# Altium schematic sheet RT v1.3_CORE.SchDoc
size A3
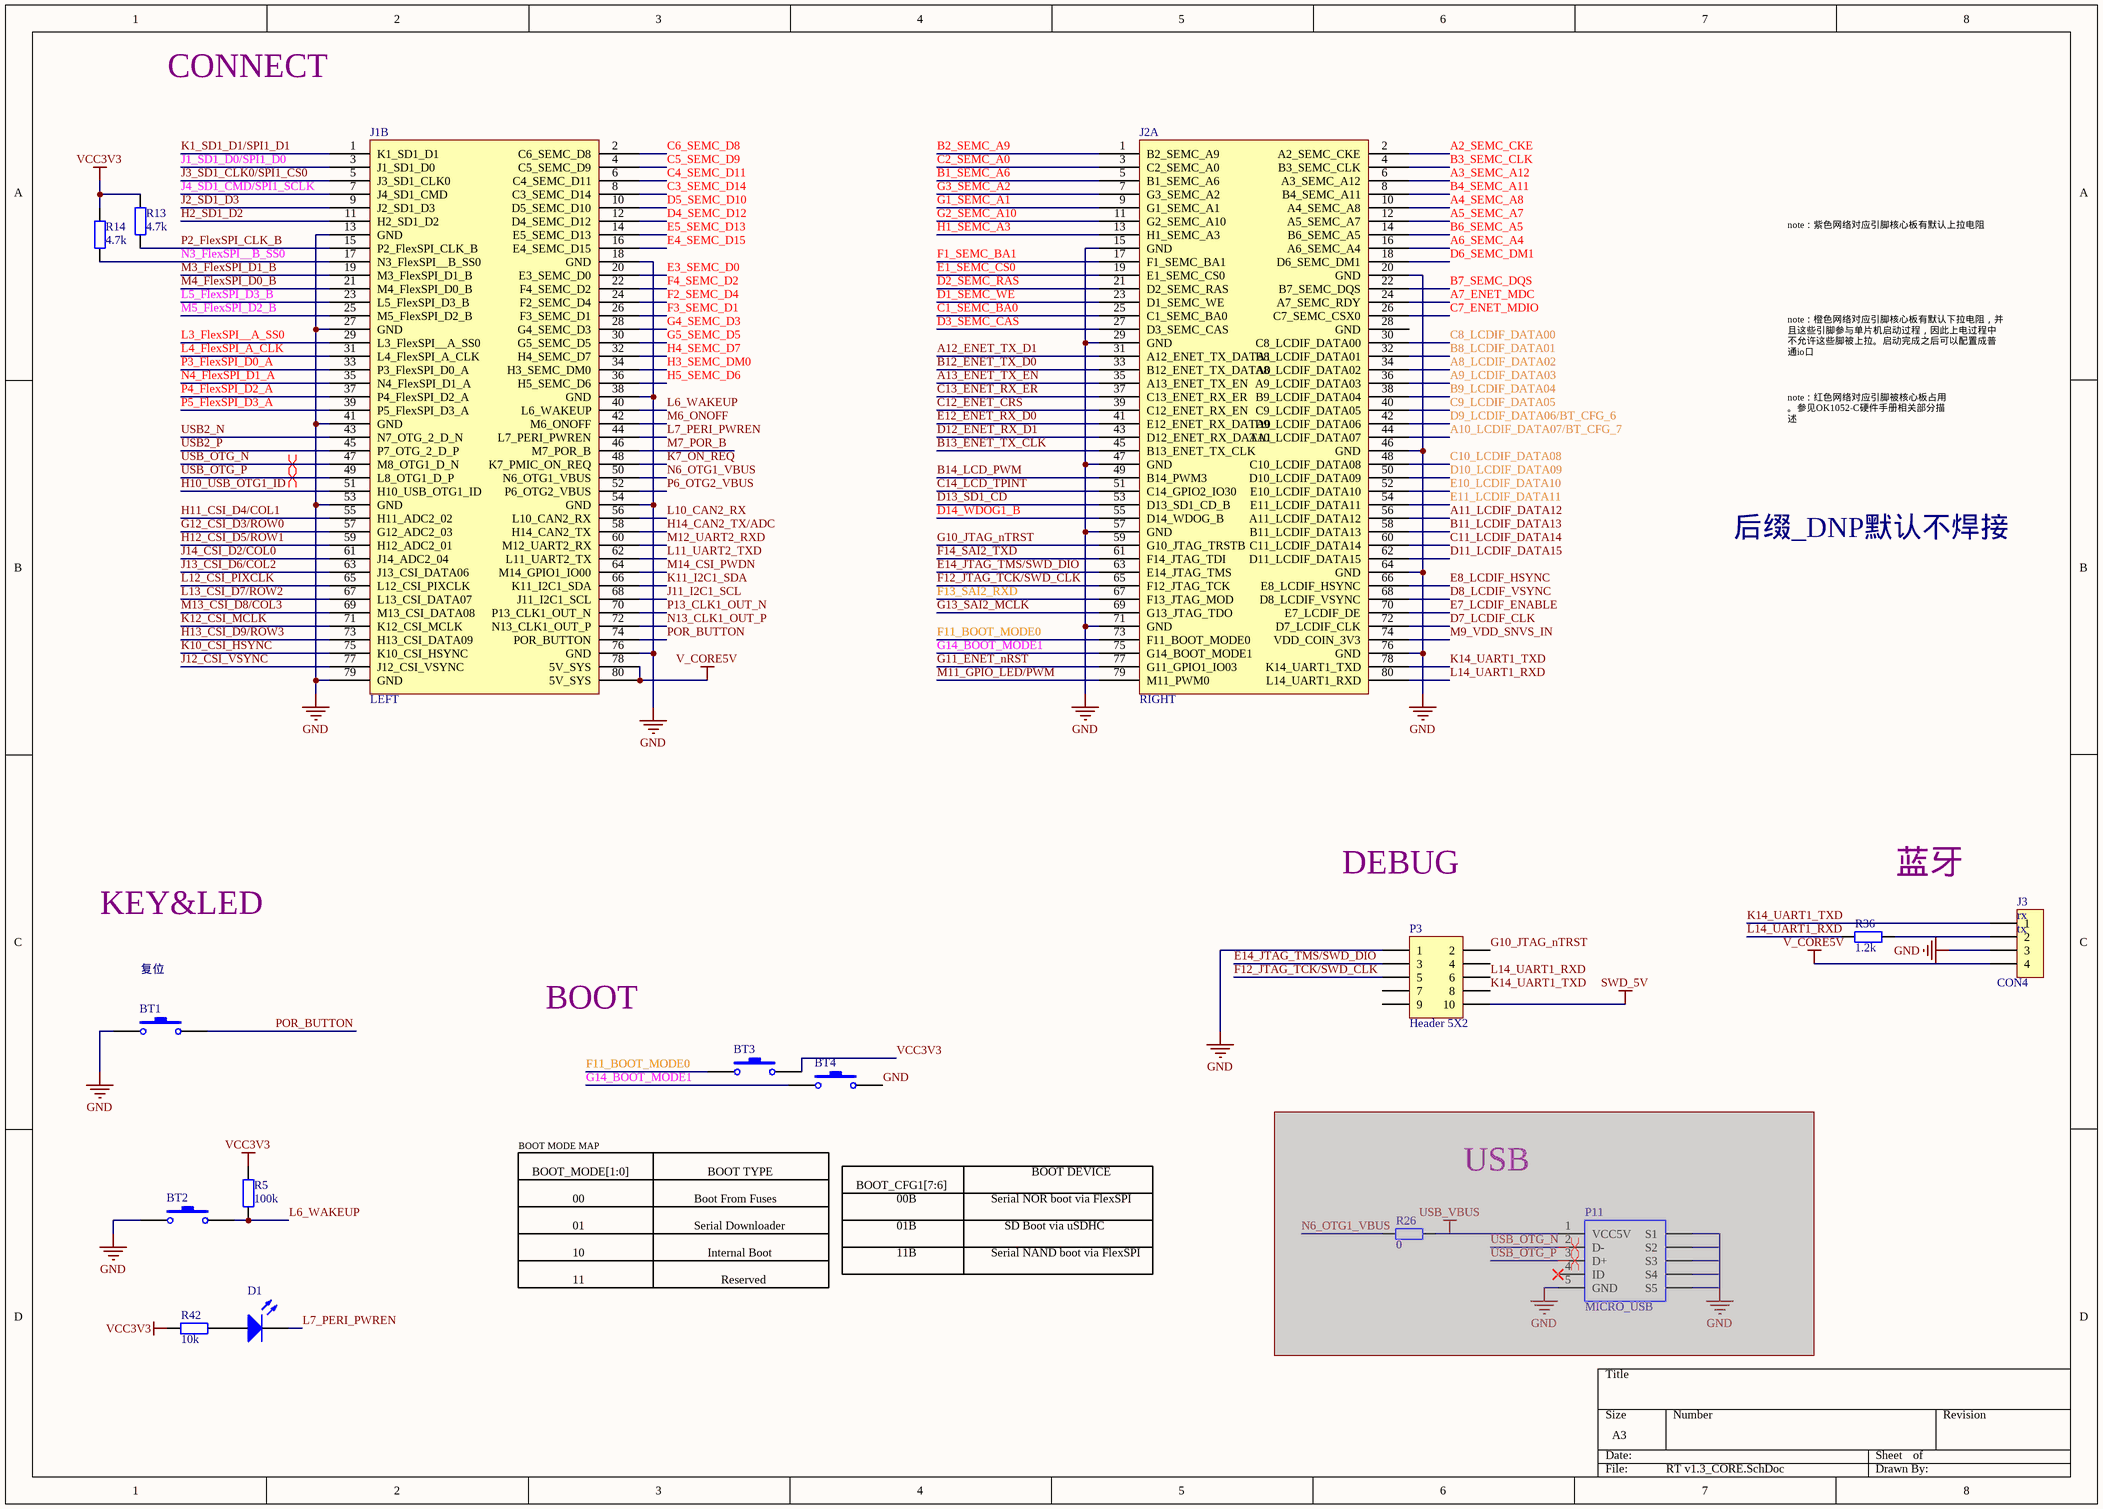
[diagram p0: RT v1.3_CORE.SchDoc]

## Parts
BT1  按键  [2脚小按键_贴]  (value not drawn)
BT2  按键  [2脚小按键_贴]  (value not drawn)
BT3  按键  [2脚小按键_贴]  (value not drawn)
BT4  按键  [2脚小按键_贴]  (value not drawn)
D1  LED2  [LED_0603_G]  (value not drawn)
J1  LEFT  [CON80]  (part B of 2)
J2  RIGHT  [CON80]  (part A of 2)
J3  CON4  [Fe-HDR1X4/2.54-S]
P3  Header 5X2  [HDR2X5]
P11  MICRO_USB  [microUSB]  (masked out: inside a compile mask, not in the netlist)
R5  value 100k  [0603R]  (hidden comment: 470欧)
R13  value 4.7k  [0603R]  (hidden comment: 470欧)
R14  value 4.7k  [0603R]  (hidden comment: 470欧)
R26  value 0  [0603R]  (hidden comment: 470欧)  (masked out: inside a compile mask, not in the netlist)
R36  value 1.2k  [0603R]  (hidden comment: 470欧)
R42  value 10k  [0603R]  (hidden comment: 470欧)

## Nets
GND: BT1.1 BT2.1 BT4.2 J1.13(GND) J1.18(GND) J1.27(GND) J1.38(GND) J1.41(GND) J1.53(GND) J1.54(GND) J1.76(GND) J1.79(GND) J2.15(GND) J2.20(GND) J2.29(GND) J2.46(GND) J2.47(GND) J2.57(GND) J2.64(GND) J2.71(GND) J2.76(GND) J3.3 P3.1
SWD_5V: P3.10
V_CORE5V: J1.78(5V_SYS) J1.80(5V_SYS) J3.4
VCC3V3: BT3.2 R5.2 R13.2 R14.2 R42.2
A2_SEMC_CKE: J2.2(A2_SEMC_CKE)
A3_SEMC_A12: J2.6(A3_SEMC_A12)
A4_SEMC_A8: J2.10(A4_SEMC_A8)
A5_SEMC_A7: J2.12(A5_SEMC_A7)
A6_SEMC_A4: J2.16(A6_SEMC_A4)
A7_ENET_MDC: J2.24(A7_SEMC_RDY)
A8_LCDIF_DATA02: J2.34(A8_LCDIF_DATA02)
A9_LCDIF_DATA03: J2.36(A9_LCDIF_DATA03)
A10_LCDIF_DATA07/BT_CFG_7: J2.44(A10_LCDIF_DATA07)
A11_LCDIF_DATA12: J2.56(A11_LCDIF_DATA12)
A12_ENET_TX_D1: J2.31(A12_ENET_TX_DATA1)
A13_ENET_TX_EN: J2.35(A13_ENET_TX_EN)
B1_SEMC_A6: J2.5(B1_SEMC_A6)
B2_SEMC_A9: J2.1(B2_SEMC_A9)
B3_SEMC_CLK: J2.4(B3_SEMC_CLK)
B4_SEMC_A11: J2.8(B4_SEMC_A11)
B6_SEMC_A5: J2.14(B6_SEMC_A5)
B7_SEMC_DQS: J2.22(B7_SEMC_DQS)
B8_LCDIF_DATA01: J2.32(B8_LCDIF_DATA01)
B9_LCDIF_DATA04: J2.38(B9_LCDIF_DATA04)
B11_LCDIF_DATA13: J2.58(B11_LCDIF_DATA13)
B12_ENET_TX_D0: J2.33(B12_ENET_TX_DATA0)
B13_ENET_TX_CLK: J2.45(B13_ENET_TX_CLK)
B14_LCD_PWM: J2.49(B14_PWM3)
C1_SEMC_BA0: J2.25(C1_SEMC_BA0)
C2_SEMC_A0: J2.3(C2_SEMC_A0)
C3_SEMC_D14: J1.8(C3_SEMC_D14)
C4_SEMC_D11: J1.6(C4_SEMC_D11)
C5_SEMC_D9: J1.4(C5_SEMC_D9)
C6_SEMC_D8: J1.2(C6_SEMC_D8)
C7_ENET_MDIO: J2.26(C7_SEMC_CSX0)
C8_LCDIF_DATA00: J2.30(C8_LCDIF_DATA00)
C9_LCDIF_DATA05: J2.40(C9_LCDIF_DATA05)
C10_LCDIF_DATA08: J2.48(C10_LCDIF_DATA08)
C11_LCDIF_DATA14: J2.60(C11_LCDIF_DATA14)
C12_ENET_CRS: J2.39(C12_ENET_RX_EN)
C13_ENET_RX_ER: J2.37(C13_ENET_RX_ER)
C14_LCD_TPINT: J2.51(C14_GPIO2_IO30)
D1_SEMC_WE: J2.23(D1_SEMC_WE)
D2_SEMC_RAS: J2.21(D2_SEMC_RAS)
D3_SEMC_CAS: J2.27(D3_SEMC_CAS)
D4_SEMC_D12: J1.12(D4_SEMC_D12)
D5_SEMC_D10: J1.10(D5_SEMC_D10)
D6_SEMC_DM1: J2.18(D6_SEMC_DM1)
D7_LCDIF_CLK: J2.72(D7_LCDIF_CLK)
D8_LCDIF_VSYNC: J2.68(D8_LCDIF_VSYNC)
D9_LCDIF_DATA06/BT_CFG_6: J2.42(D9_LCDIF_DATA06)
D10_LCDIF_DATA09: J2.50(D10_LCDIF_DATA09)
D11_LCDIF_DATA15: J2.62(D11_LCDIF_DATA15)
D12_ENET_RX_D1: J2.43(D12_ENET_RX_DATA1)
D13_SD1_CD: J2.53(D13_SD1_CD_B)
D14_WDOG1_B: J2.55(D14_WDOG_B)
E1_SEMC_CS0: J2.19(E1_SEMC_CS0)
E3_SEMC_D0: J1.20(E3_SEMC_D0)
E4_SEMC_D15: J1.16(E4_SEMC_D15)
E5_SEMC_D13: J1.14(E5_SEMC_D13)
E7_LCDIF_ENABLE: J2.70(E7_LCDIF_DE)
E8_LCDIF_HSYNC: J2.66(E8_LCDIF_HSYNC)
E10_LCDIF_DATA10: J2.52(E10_LCDIF_DATA10)
E11_LCDIF_DATA11: J2.54(E11_LCDIF_DATA11)
E12_ENET_RX_D0: J2.41(E12_ENET_RX_DATA0)
E14_JTAG_TMS/SWD_DIO: J2.63(E14_JTAG_TMS) P3.3
F1_SEMC_BA1: J2.17(F1_SEMC_BA1)
F2_SEMC_D4: J1.24(F2_SEMC_D4)
F3_SEMC_D1: J1.26(F3_SEMC_D1)
F4_SEMC_D2: J1.22(F4_SEMC_D2)
F11_BOOT_MODE0: BT3.1 J2.73(F11_BOOT_MODE0)
F12_JTAG_TCK/SWD_CLK: J2.65(F12_JTAG_TCK) P3.5
F13_SAI2_RXD: J2.67(F13_JTAG_MOD)
F14_SAI2_TXD: J2.61(F14_JTAG_TDI)
G1_SEMC_A1: J2.9(G1_SEMC_A1)
G2_SEMC_A10: J2.11(G2_SEMC_A10)
G3_SEMC_A2: J2.7(G3_SEMC_A2)
G4_SEMC_D3: J1.28(G4_SEMC_D3)
G5_SEMC_D5: J1.30(G5_SEMC_D5)
G10_JTAG_nTRST: J2.59(G10_JTAG_TRSTB) P3.2
G11_ENET_nRST: J2.77(G11_GPIO1_IO03)
G12_CSI_D3/ROW0: J1.57(G12_ADC2_03)
G13_SAI2_MCLK: J2.69(G13_JTAG_TDO)
G14_BOOT_MODE1: BT4.1 J2.75(G14_BOOT_MODE1)
H1_SEMC_A3: J2.13(H1_SEMC_A3)
H2_SD1_D2: J1.11(H2_SD1_D2)
H3_SEMC_DM0: J1.34(H3_SEMC_DM0)
H4_SEMC_D7: J1.32(H4_SEMC_D7)
H5_SEMC_D6: J1.36(H5_SEMC_D6)
H10_USB_OTG1_ID: J1.51(H10_USB_OTG1_ID)
H11_CSI_D4/COL1: J1.55(H11_ADC2_02)
H12_CSI_D5/ROW1: J1.59(H12_ADC2_01)
H13_CSI_D9/ROW3: J1.73(H13_CSI_DATA09)
H14_CAN2_TX/ADC: J1.58(H14_CAN2_TX)
J1_SD1_D0/SPI1_D0: J1.3(J1_SD1_D0)
J2_SD1_D3: J1.9(J2_SD1_D3)
J3_SD1_CLK0/SPI1_CS0: J1.5(J3_SD1_CLK0)
J4_SD1_CMD/SPI1_SCLK: J1.7(J4_SD1_CMD)
J11_I2C1_SCL: J1.68(J11_I2C1_SCL)
J12_CSI_VSYNC: J1.77(J12_CSI_VSYNC)
J13_CSI_D6/COL2: J1.63(J13_CSI_DATA06)
J14_CSI_D2/COL0: J1.61(J14_ADC2_04)
K1_SD1_D1/SPI1_D1: J1.1(K1_SD1_D1)
K7_ON_REQ: J1.48(K7_PMIC_ON_REQ)
K10_CSI_HSYNC: J1.75(K10_CSI_HSYNC)
K11_I2C1_SDA: J1.66(K11_I2C1_SDA)
K12_CSI_MCLK: J1.71(K12_CSI_MCLK)
K14_UART1_TXD: J2.78(K14_UART1_TXD) J3.1 P3.8
L3_FlexSPI__A_SS0: J1.29(L3_FlexSPI__A_SS0)
L4_FlexSPI_A_CLK: J1.31(L4_FlexSPI_A_CLK)
L5_FlexSPI_D3_B: J1.23(L5_FlexSPI_D3_B)
L6_WAKEUP: BT2.2 J1.40(L6_WAKEUP) R5.1
L7_PERI_PWREN: D1.2(K) J1.44(L7_PERI_PWREN)
L10_CAN2_RX: J1.56(L10_CAN2_RX)
L11_UART2_TXD: J1.62(L11_UART2_TX)
L12_CSI_PIXCLK: J1.65(L12_CSI_PIXCLK)
L13_CSI_D7/ROW2: J1.67(L13_CSI_DATA07)
L14_UART1_RXD: J2.80(L14_UART1_RXD) P3.6 R36.1
M3_FlexSPI_D1_B: J1.19(M3_FlexSPI_D1_B)
M4_FlexSPI_D0_B: J1.21(M4_FlexSPI_D0_B)
M5_FlexSPI_D2_B: J1.25(M5_FlexSPI_D2_B)
M6_ONOFF: J1.42(M6_ONOFF)
M7_POR_B: J1.46(M7_POR_B)
M9_VDD_SNVS_IN: J2.74(VDD_COIN_3V3)
M11_GPIO_LED/PWM: J2.79(M11_PWM0)
M12_UART2_RXD: J1.60(M12_UART2_RX)
M13_CSI_D8/COL3: J1.69(M13_CSI_DATA08)
M14_CSI_PWDN: J1.64(M14_GPIO1_IO00)
N3_FlexSPI__B_SS0: J1.17(N3_FlexSPI__B_SS0) R14.1
N4_FlexSPI_D1_A: J1.35(N4_FlexSPI_D1_A)
N6_OTG1_VBUS: J1.50(N6_OTG1_VBUS)
N13_CLK1_OUT_P: J1.72(N13_CLK1_OUT_P)
P2_FlexSPI_CLK_B: J1.15(P2_FlexSPI_CLK_B) R13.1
P3_FlexSPI_D0_A: J1.33(P3_FlexSPI_D0_A)
P4_FlexSPI_D2_A: J1.37(P4_FlexSPI_D2_A)
P5_FlexSPI_D3_A: J1.39(P5_FlexSPI_D3_A)
P6_OTG2_VBUS: J1.52(P6_OTG2_VBUS)
P13_CLK1_OUT_N: J1.70(P13_CLK1_OUT_N)
POR_BUTTON: BT1.2 J1.74(POR_BUTTON)
USB2_N: J1.43(N7_OTG_2_D_N)
USB2_P: J1.45(P7_OTG_2_D_P)
USB_OTG_N: J1.47(M8_OTG1_D_N)
USB_OTG_P: J1.49(L8_OTG1_D_P)
NetD1_1: D1.1(A) R42.1
NetJ3_2: J3.2 R36.2

Not connected (* = marked no-connect by the designer): J2 28(GND); P3 4 7 9

## Layout directives
differential pair: (no net found under the mark), USB_OTG_N, USB_OTG_P

## Notes on the sheet
- CONNECT
- note：紫色网络对应引脚核心板有默认上拉电阻
- note：橙色网络对应引脚核心板有默认下拉电阻，并且这些引脚参与单片机启动过程，因此上电过程中不允许这些脚被上拉。启动完成之后可以配置成普通io口
- note：红色网络对应引脚被核心板占用。参见OK1052-C硬件手册相关部分描述
- 后缀_DNP默认不焊接
- KEY&LED
- DEBUG
- 蓝牙
- (near J3) rx
- 复位
- (near J3) tx
- BOOT
- BOOT MODE MAP
- BOOT_MODE[1:0]
- BOOT TYPE
- BOOT_CFG1[7:6]
- BOOT DEVICE
- USB
- 00
- 01
- 10
- Boot From Fuses
- Serial Downloader
- Internal Boot
- 00B
- 01B
- 11B
- Serial NOR boot via FlexSPI
- Serial NAND boot via FlexSPI
- SD Boot via uSDHC
- 11
- Reserved

## Library data of the parts
BT1-BT4 = 按键: Switch; Published: 24-Mar-1999; LatestRevisionDate: 17-Jul-2002; LatestRevisionNote: Re-released for DXP Platform.; PackageReference: SPST-2; Publisher: Altium Limited; PackageDescription: Switch; 2 Leads
D1 = LED2: Typical RED, GREEN, YELLOW, AMBER GaAs LED; Published: 8-Jun-2000; LatestRevisionDate: 17-Jul-2002; LatestRevisionNote: Re-released for DXP Platform.; PackageDocument: Feb-2002; PackageReference: 3.2X1.6X1.1; Publisher: Altium Limited
J1 J2 = imxrt1052
J3 = CON4: Connector
P3 = Header 5X2: Header, 5-Pin, Dual row; LatestRevisionDate: 17-Jul-2002; LatestRevisionNote: Re-released for DXP Platform.; Publisher: Altium Limited
P11 = MICRO_USB: Header, 5-Pin, Dual row; LatestRevisionDate: 17-Jul-2002; LatestRevisionNote: Re-released for DXP Platform.; Publisher: Altium Limited; VALUE: MICRO_USB
R5 R13 R14 R26 R36 R42 = Res2_1: Resistor; Published: 8-Jun-2000; LatestRevisionDate: 17-Jul-2002; LatestRevisionNote: Re-released for DXP Platform.; PackageReference: AXIAL-0.4; Publisher: Altium Limited